# EAGLE schematic supply_dist_v1 (EAGLE 6.5.0)
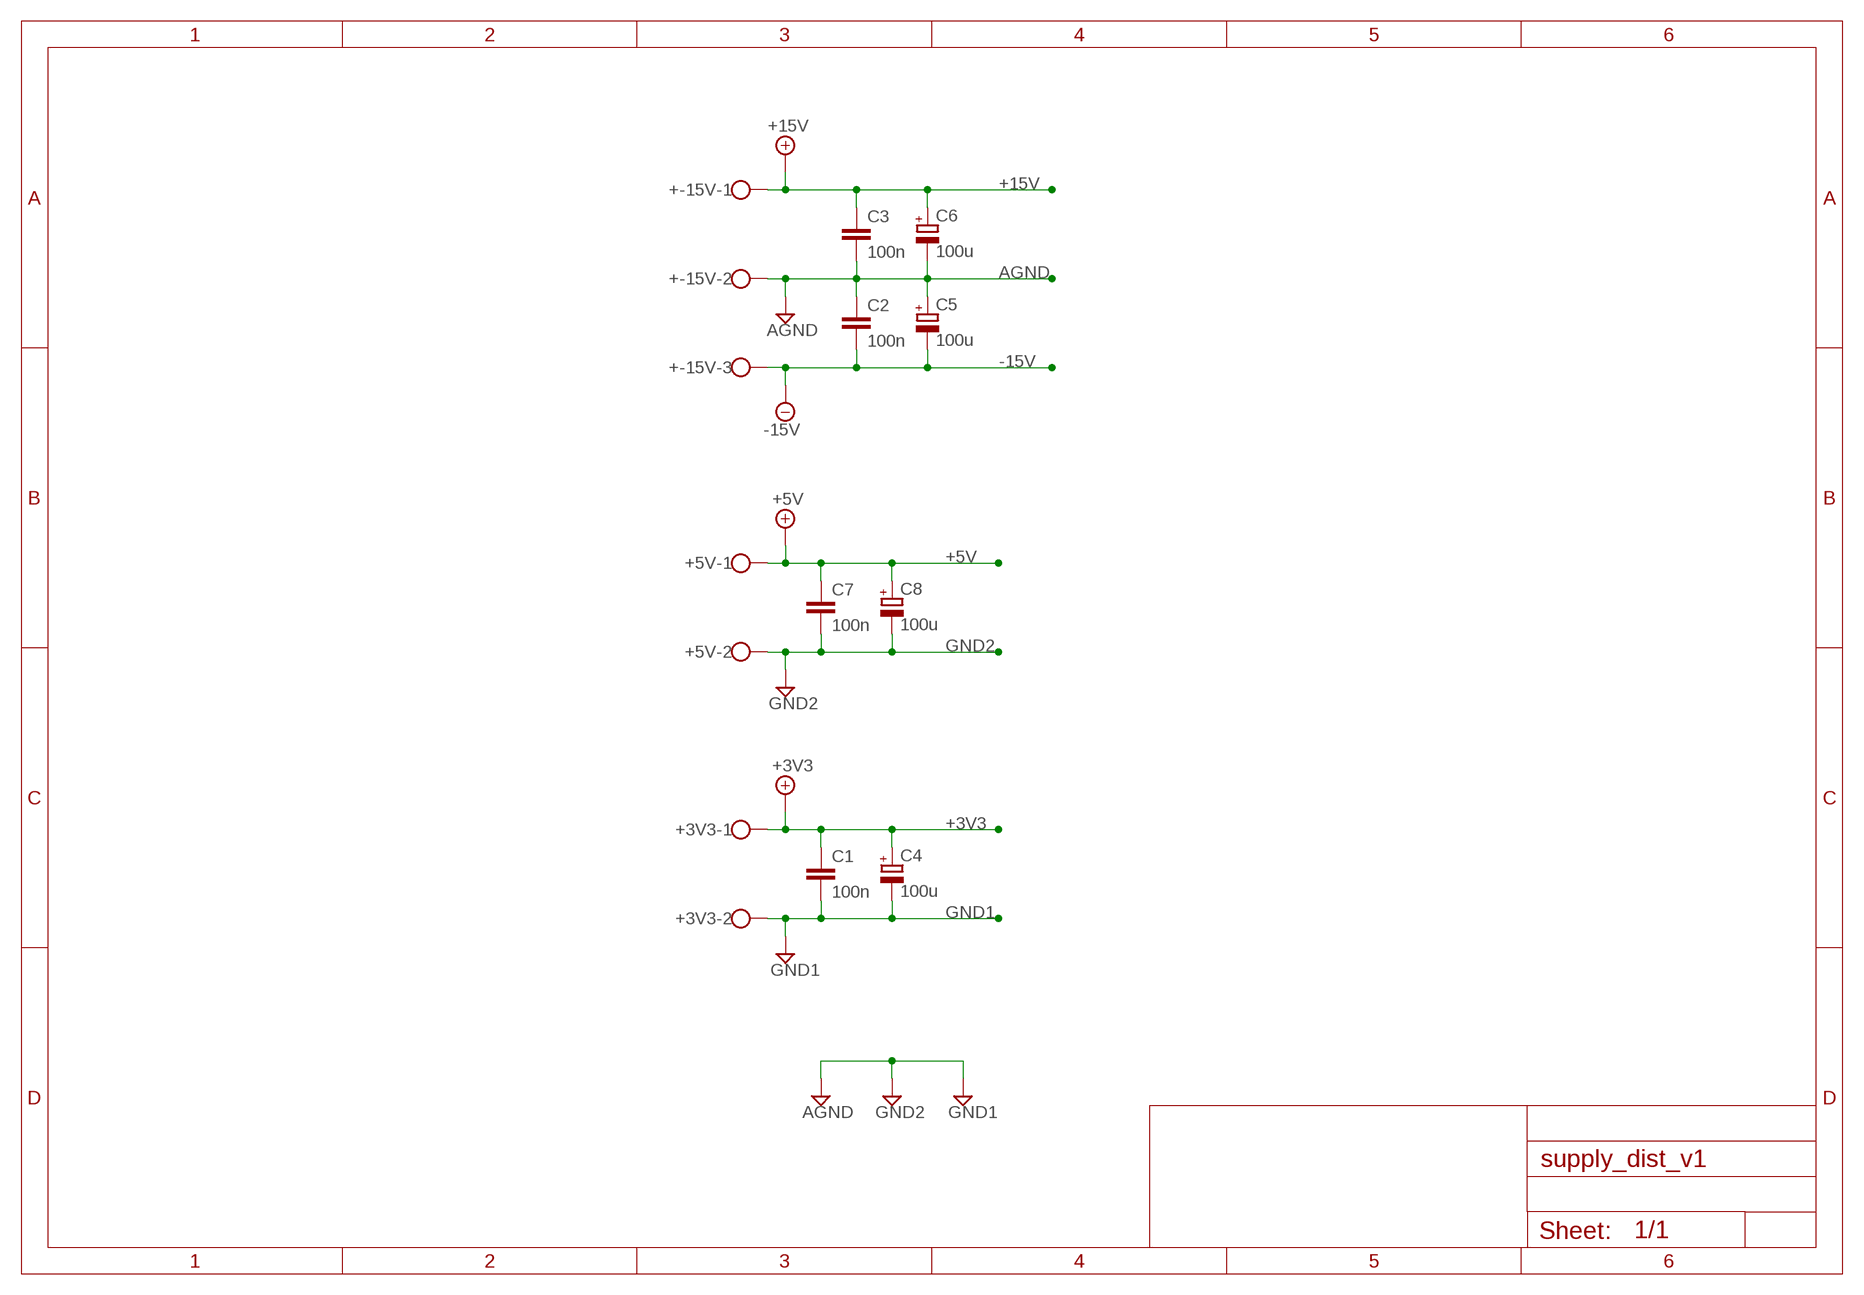
[diagram p0: schematic, sheet 1]

## Parts
+3V3  W237-102  [W237-102]
+5V  W237-102  [W237-102]
+-15V  W237-103  [W237-103]
C1  100n  C2,5-3  [C2.5-3]
C2  100n  C2,5-3  [C2.5-3]
C3  100n  C2,5-3  [C2.5-3]
C4  100u  CPOL-EUE2.5-7  [E2,5-7]
C5  100u  CPOL-EUE2.5-7  [E2,5-7]
C6  100u  CPOL-EUE2.5-7  [E2,5-7]
C7  100n  C2,5-3  [C2.5-3]
C8  100u  CPOL-EUE2.5-7  [E2,5-7]

## Nets
+3V3: +3V3.1 C1.1 C4.+
+5V: +5V.1 C7.1 C8.+
+15V: +-15V.1 C3.1 C6.+
-15V: +-15V.3 C2.2 C5.-
AGND: +-15V.2 C2.1 C3.2 C5.+ C6.-
GND1: +3V3.2 C1.2 C4.-
GND2: +5V.2 C7.2 C8.- ; supply symbol labelled AGND, GND1

## Library data of the parts
+3V3 +5V = con-wago-500:W237-102: WAGO SCREW CLAMP; MPN: 237-102; OC_FARNELL: unknown; OC_NEWARK: 70K9898
+-15V = con-wago-500:W237-103: WAGO SCREW CLAMP; MPN: 237-103; OC_FARNELL: unknown; OC_NEWARK: 18M7116
C1-C3 C7 = capacitor-wima:C: CAPACITOR naming: grid - package width
C4-C6 C8 = rcl:CPOL-EU: POLARIZED CAPACITOR, European symbol